# EasyEDA Pro project 激光灯驱动板.eprj

# Schematic Schematic1
Create Date: 2025-07-24; Page Name: P1; Project Name: 激光灯驱动板; Schematic Name: Schematic1; Update Date: 2025-07-24; Add into BOM: yes; Company: 嘉立创EDA; Convert to PCB: yes; Page Size: A4; Version: V1.0
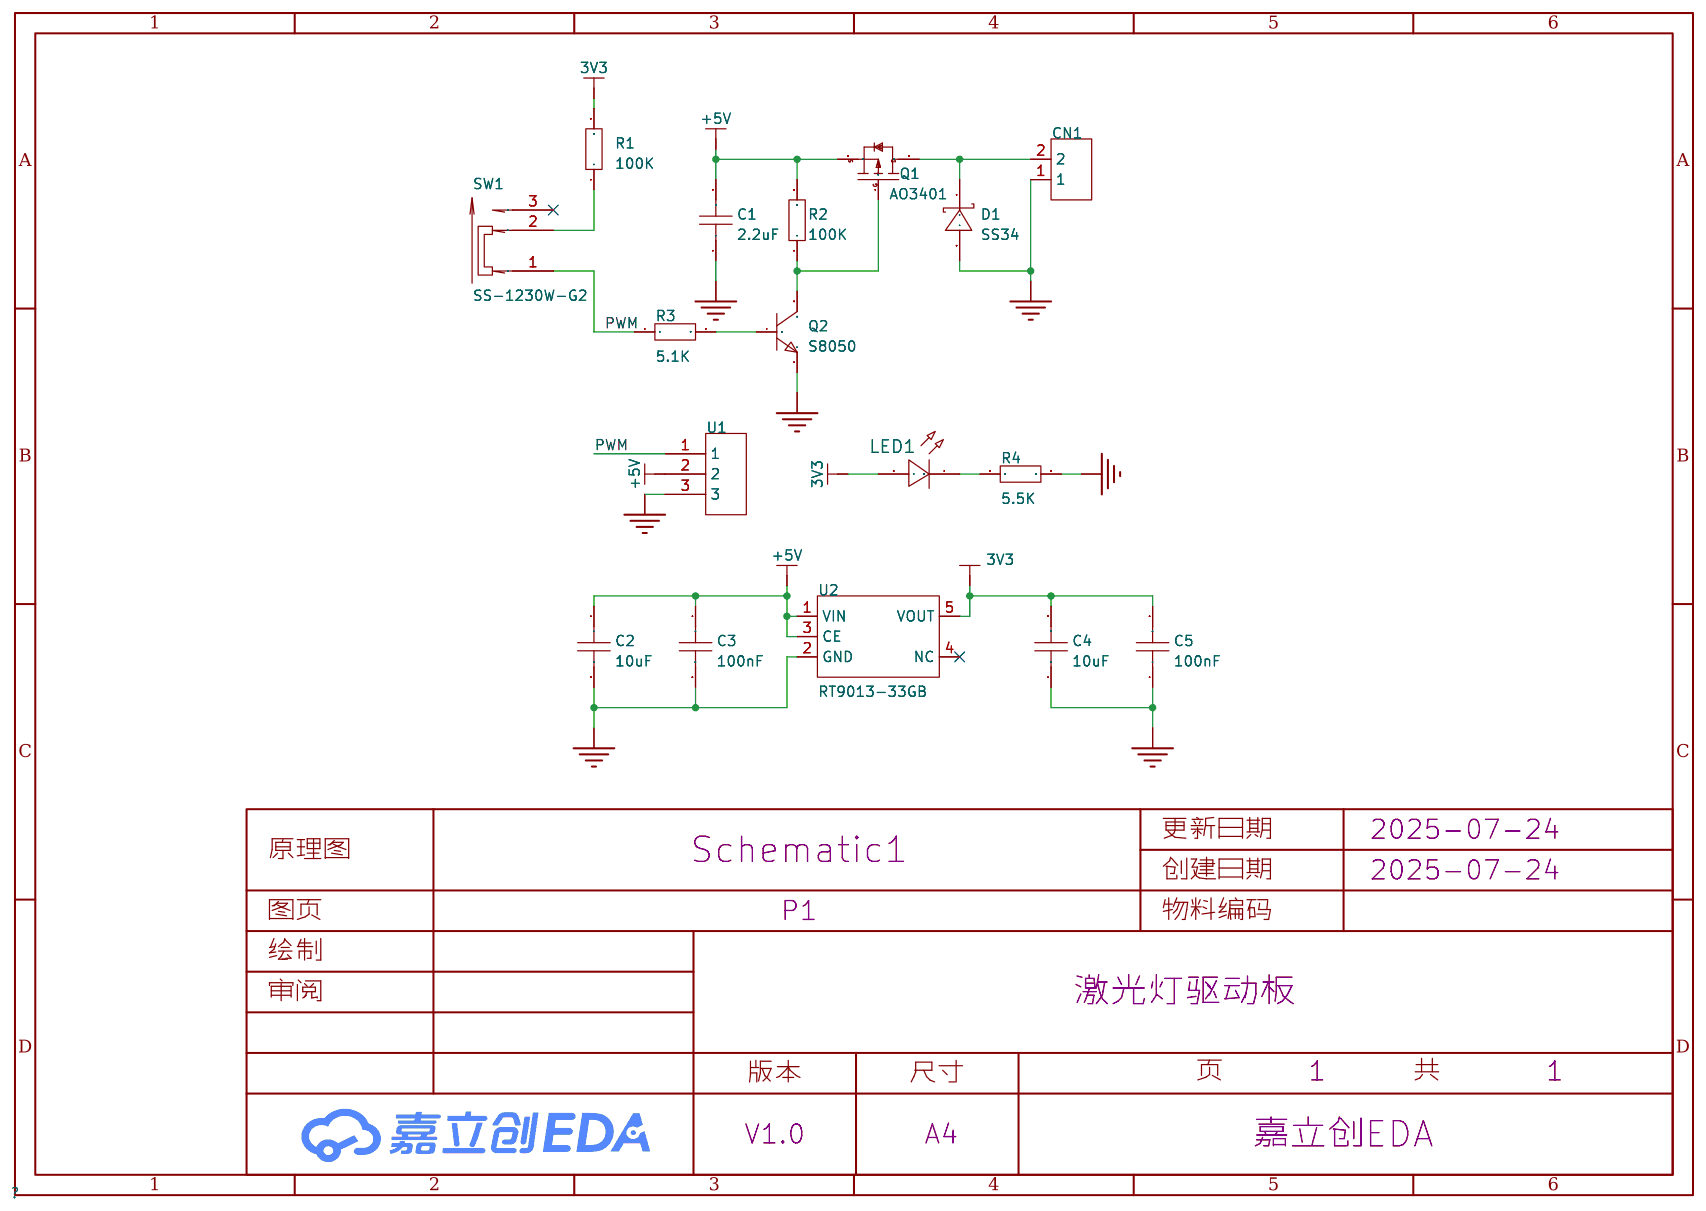
[diagram p0: schematic sheet]

## Parts
C1  2.2uF  [C0603]
C2  10uF  [C0603]
C3  100nF  [C0603]
C4  10uF  [C0603]
C5  100nF  [C0603]
CN1  XH2.54-2PIN-直针  [CONN-TH_XH2.54-2P]
D1  SS34  [SMA_L4.3-W2.6-LS5.0-RD]
LED1  -  [LED_0603]
Q1  AO3401  [SOT-23-3_L2.9-W1.6-P1.90-LS2.8-BR]
Q2  S8050  [SOT-23-3_L2.9-W1.3-P1.90-LS2.4-BR]
R1  100K  [R0603]
R2  100K  [R0603]
R3  5.1K  [R0603]
R4  5.5K  [R0603]
SW1  SS-1230W-G2  [SW-SMD_SS-1230W-G2]
U1  -  [X2.54_3p]
U2  RT9013-33GB  [SOT-23-5_L2.9-W1.6-P0.95-LS2.8-BR]

## Library data of the parts
C1-C5 = CAP_0603: Supplier Footprint: 0603
CN1 = XH2.54-2PIN-直针: Supplier Part: C9900011425; Supplier Footprint: XH2.54-2PIN; JLCPCB Part Class: 扩展库; Supplier: LCSC
D1 = SS34: Supplier Part: C9900023345; Supplier Footprint: SMA,DO-214AC; JLCPCB Part Class: 扩展库; Supplier: LCSC
LED1 = LED_0603-R: Supplier Footprint: 0603
Q1 = AO3401: Supplier Part: C9900008520; Supplier Footprint: SOT-23; JLCPCB Part Class: 扩展库; Supplier: LCSC
Q2 = S8050: NPN 25V 500mA 120-400 SOT-23; Supplier Part: C2931719; Manufacturer: Doeshare(德芯); Supplier Footprint: SOT-23; JLCPCB Part Class: 扩展库; Datasheet: https://atta.szlcsc.com/upload/public/pdf/source/20220117/E6D3315E0D6ADDB25840BFFAC039C5C0.pdf; Supplier: LCSC
R1-R4 = Res_0603: Supplier Footprint: 0603
SW1 = SS-1230W-G2: LCSC Part Name: 拨动开关; Supplier Part: C589311; Manufacturer: RISHENG(日昇); Supplier Footprint: SMD; JLCPCB Part Class: 扩展库; Datasheet: https://atta.szlcsc.com/upload/public/pdf/source/20200922/C589311_BFCBAFA1F052995213AEF8A9F4D26E72.pdf; Supplier: LCSC
U1 = X2.54 _3p
U2 = RT9013-33GB_C19268157: 输出类型:固定;工作电压:7V;输出电压:3.3V;输出电流:500mA;电源纹波抑制比(PSRR):-;输出极性:正极;; Supplier Part: C19268157; Manufacturer: TECH PUBLIC(台舟); Supplier Footprint: SOT-23-5; JLCPCB Part Class: 扩展库; Datasheet: https://atta.szlcsc.com/upload/public/pdf/source/20231201/9D78CA17020D67EC103F1AC7C29CF260.pdf; Supplier: LCSC; Output Type: 固定; Voltage - Supply: 7V; Output Voltage: 3.3V; Output Current: 500mA; Operating Temperature: -40℃~+85℃@(Ta); Output Configuration: 正极; Number of Outputs: 1

## Nets
3V3: C4.2 C5.2 LED1.2(A) R1.2 U2.5(VOUT)
+5V: C1.2 C2.1 C3.1 Q1.2(S) R2.2 U1.2 U2.1(VIN) U2.3(CE)
GND: C1.1 C2.2 C3.2 C4.1 C5.1 CN1.1 D1.2(A) Q2.2(E) R4.2 U1.3 U2.2(GND)
PWM: R3.1 SW1.1 U1.1
$1N284: Q2.1(B) R3.2
$1N289: Q1.1(G) Q2.3(C) R2.1
$1N290: CN1.2 D1.1(K) Q1.3(D)
$1N1303: R1.1 SW1.2
$1N1519: LED1.1(C) R4.1

Not connected (* = marked no-connect by the designer): SW1 3*; U2 4(NC)*

# Board PCB1
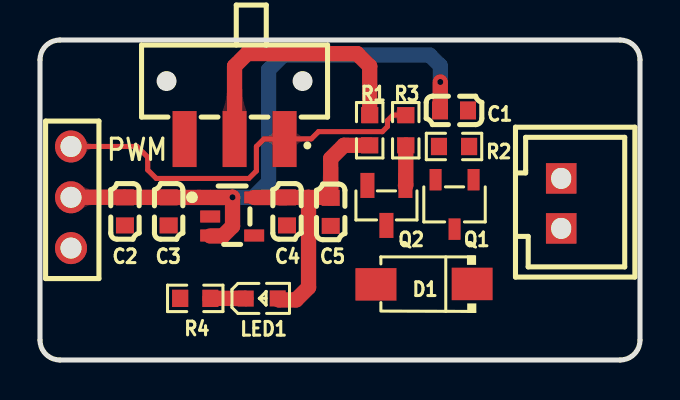
[diagram p1: board, top side]
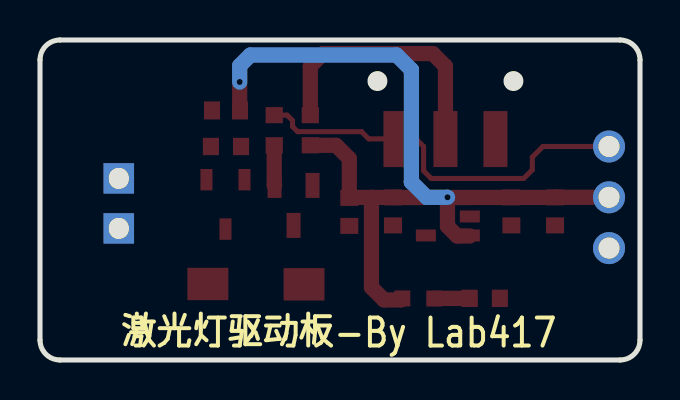
[diagram p2: board, bottom side, seen from below]

Outline 30 x 16 mm; copper layers: Top Layer, Bottom Layer. Coordinates in mm from the lower left corner of the outline.
Outline path: 0,15 0,1 arc(0.29,0.29) 1,0 29,0 arc(29.71,0.29) 30,1 30,15 arc(29.71,15.71) 29,16 1,16 arc(0.29,15.71) 0,15
Stack: Top Layer 0.035mm - / Dielectric1 1.51mm FR4 er 4.5 / Bottom Layer 0.035mm -

## Design rules (mm)
template: 自定义配置
spacing copperThickness1oz (default): track to track 0.102, other pairs 0.152 to 0.3
spacing copperThickness2oz: track to track 0.203, other pairs 0.152 to 0.3
track width copperThickness1oz (default): min 0.127, default 0.254, max 2.54
track width copperThickness2oz: min 0.203, default 0.254, max 2.54
differential pair differentialPair (default): width min 0.127, default 0.254, max 2.54; gap min 0.152, default 0.152
via viaSize (default): diameter min 0.5, default 0.61, max 10; hole min 0.3, default 0.305, max 6.3

## Placement (name value [footprint] x y rotation side)
C1  2.2uF  [C0603]  20.7 12.48 180 top
C2  10uF  [C0603]  4.25 7.43 270 top
C3  100nF  [C0603]  6.43 7.43 270 top
C4  10uF  [C0603]  12.35 7.43 90 top
C5  100nF  [C0603]  14.53 7.41 90 top
CN1  XH2.54-2PIN-直针  [CONN-TH_XH2.54-2P]  26.06 7.83 270 top
D1  SS34  [SMA_L4.3-W2.6-LS5.0-RD]  19.2 3.79 180 top
LED1  -  [LED_0603]  11.14 3.08 0 top
Q1  AO3401  [SOT-23-3_L2.9-W1.6-P1.90-LS2.8-BR]  20.73 7.78 90 top
Q2  S8050  [SOT-23-3_L2.9-W1.3-P1.90-LS2.4-BR]  17.32 7.73 90 top
R1  100K  [R0603]  16.48 11.49 270 top
R2  100K  [R0603]  20.7 10.68 180 top
R3  5.1K  [R0603]  18.29 11.49 270 top
R4  5.5K  [R0603]  7.76 3.08 180 top
SW1  SS-1230W-G2  [SW-SMD_SS-1230W-G2]  9.73 11.05 180 top
U1  -  [X2.54_3p]  1.55 9.41 270 top
U2  RT9013-33GB  [SOT-23-5_L2.9-W1.6-P0.95-LS2.8-BR]  9.61 7.18 180 top

## Footprints (pads in the part's own frame, mm; a bottom-side part is the same pattern mirrored in y, then rotated)
C0603
  rect 0.8x0.9 smd: 1(-0.7,0) 2(0.7,0)
CONN-TH_XH2.54-2P
  rect 1.524x1.524 hole 1.05x1: 1(-1.25,0) 2(1.25,0)
LED_0603
  rect 0.8x0.8 smd: 1(-0.851,-0.01) 2(0.75,-0.005)
R0603
  rect 0.806x0.864 smd: 1(-0.753,0) 2(0.753,0)
SMA_L4.3-W2.6-LS5.0-RD
  rect 2.046x1.62 smd: 1(-2.404,-0.009) 2(2.404,0.009)
SOT-23-3_L2.9-W1.3-P1.90-LS2.4-BR
  rect 1.25x0.7 smd: 1(1,-0.95) 2(1,0.95) 3(-1,0)
SOT-23-3_L2.9-W1.6-P1.90-LS2.8-BR
  rect 1.07x0.6 smd: 1(1.235,-0.95) 2(1.235,0.95) 3(-1.235,0)
SOT-23-5_L2.9-W1.6-P0.95-LS2.8-BR
  rect 1x0.6 smd: 1(1.1,-0.95) 2(1.1,0) 3(1.1,0.95) 4(-1.1,0.95) 5(-1.1,-0.95)
SW-SMD_SS-1230W-G2
  rect 1.2x2.8 smd: 1(-2.5,0) 2(0,0) 3(2.5,0)
X2.54_3p
  round 1.6 hole 1.05: 1(-1.27,0) 2(1.27,0) 3(3.81,0)

## Nets
As in the schematic.

Pads without a net: SW1 3; U2 4

## Via types
v1: diameter 0.61, hole 0.305, Top Layer to Bottom Layer, 2 vias

## Routing (per net, layer and track width the routed paths; a pad name or vN(x,y) marks a point on that pad's centre or on a via; arc(x,y) is an arc through that point)
3V3: length 14.4
  Top Layer w0.762: 14.51,8.13 14.53,8.13 14.53,10.07 15.2,10.73 R1.2 ; 14.51,8.13 13.43,8.13 ; 14.51,8.13 C5.2 ; 13.43,8.13 C4.2 12.35,8.13 U2.5 ; 13.43,8.13 13.43,3.63 12.8,3 11.96,3 11.89,3.08
+5V: length 30
  Top Layer w0.762: U2.1 9.62,8.13 v1(9.63,8.14) 9.63,6.69 9.14,6.2 8.51,6.2 ; 8.51,8.13 C3.1 C2.1 4.24,8.14 U1.2 ; 19.99,12.49 C1.2 20.01,12.49 v1(20.01,13.9)
  Bottom Layer w0.762: v1(9.63,8.14) 10.67,8.14 11.43,8.9 11.43,14.51 12.17,15.25 19.48,15.25 20.01,14.71 v1(20.01,13.9)
PWM: length 20
  Top Layer w0.254: U1.1 4.85,10.68 5.38,10.14 5.38,9.51 5.82,9.08 10.44,9.08 10.82,9.46 10.82,10.68 11.19,11.05 SW1.1 12.24,11.06 13.56,11.06 13.92,11.42 17.12,11.42 17.37,11.67 17.37,11.97 17.64,12.24 R3.1
$1N284: length 2
  Top Layer w0.762: R3.2 18.29,8.74 Q2.1
$1N1303: length 13.4
  Top Layer w0.762: R1.1 16.48,14.69 15.85,15.32 10.36,15.32 9.73,14.69 SW1.2
$1N1519: length 1.8
  Top Layer w0.762: LED1.1 10.28,3.08 R4.1

## Copper pours and planes (outline as drawn; the poured copper is in the pictures)
+5V on Top Layer: 19.1,13.44 20.7,13.44 20.7,8.4 19.1,8.4
GND on Top Layer: -1.63,20.76 31.6,20.76 31.6,-1.03 -1.63,-1.03
GND on Bottom Layer: -1.14,18.07 31.83,18.07 31.83,-1.85 -1.14,-1.85
$1N289 on Top Layer: 20.96,11.49 22.25,11.49 22.25,7.48 20.96,7.48
$1N289 on Top Layer: 22.27,8.11 19.1,8.11 19.1,7.41 16.69,7.41 16.69,6.02 19.99,6.02 19.99,7.47 22.27,7.47
$1N290 on Top Layer: 20.29,7.22 24.69,7.22 24.69,7.89 27.06,7.89 27.08,7.91 27.08,5.54 23.2,5.54 23.2,2.78 20.29,2.78

Small or netless copper shapes (teardrops, artwork), in the pictures only: 19 on Top Layer

## Text on the board
Bottom Silkscreen Layer: 激光灯驱动板-By Lab417
Top Silkscreen Layer: PWM
